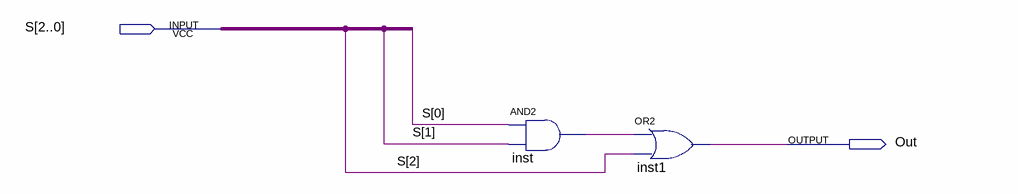
[diagram p0: schematic sheet]
// Quartus schematic output_func_detector.bdf as structural Verilog: 2 symbols, 2 pins
module output_func_detector (
  input  [2:0] S,
  output Out
);

  wire inst_out;

  and inst (inst_out, S[0], S[1]);
  or inst1 (Out, inst_out, S[2]);
endmodule
